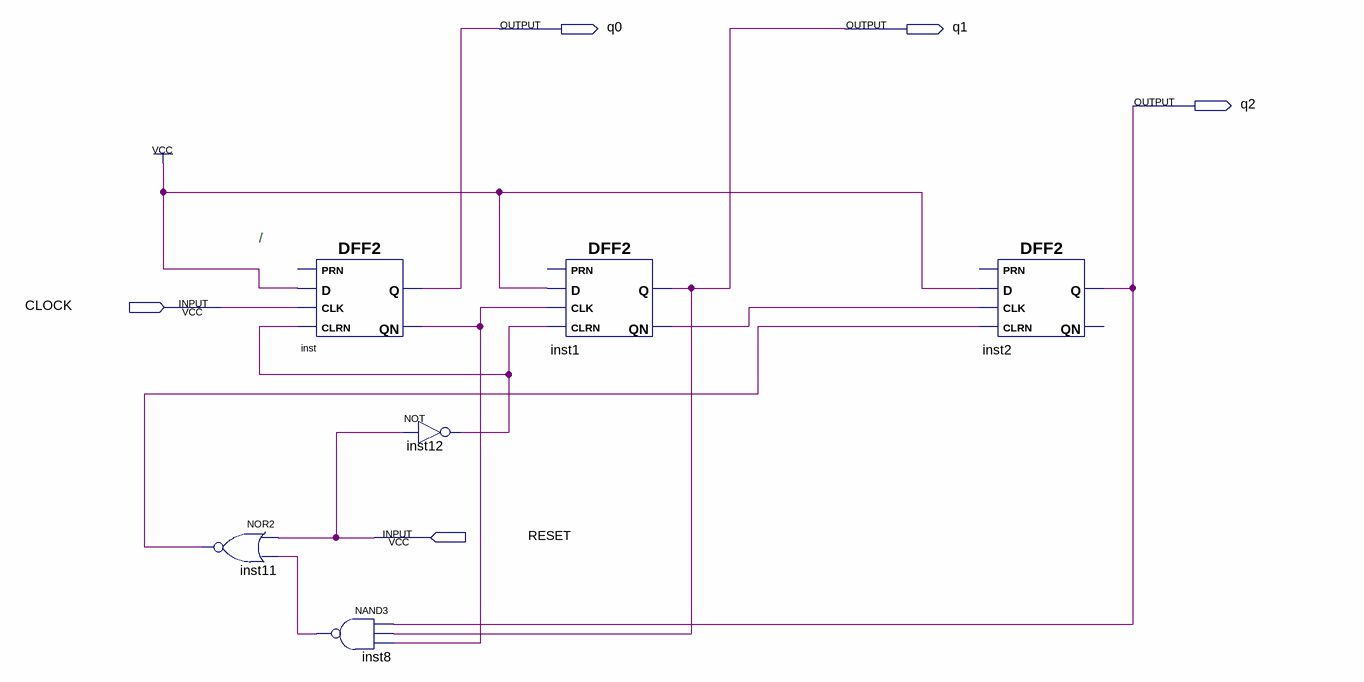
[diagram p0: schematic sheet]
// Quartus schematic contadorAsync23.bdf as structural Verilog: 6 symbols, 5 pins
module contadorAsync23 (
  input  CLOCK,
  input  RESET,
  output q0,
  output q1,
  output q2
);

  wire inst1_qn, inst8_out, inst11_out, inst12_out, inst_qn;

  nor inst11 (inst11_out, RESET, inst8_out);
  DFF2 inst (.CLK(CLOCK), .D(1'b1), .CLRN(inst12_out), .Q(q0), .QN(inst_qn));  // open: PRN
  nand inst8 (inst8_out, q2, q1, inst_qn);
  not inst12 (inst12_out, RESET);
  DFF2 inst1 (.CLK(inst_qn), .D(1'b1), .CLRN(inst12_out), .Q(q1), .QN(inst1_qn));  // open: PRN
  DFF2 inst2 (.CLK(inst1_qn), .D(1'b1), .CLRN(inst11_out), .Q(q2));  // open: PRN, QN

  // Notes on the sheet:
  //   /
endmodule
